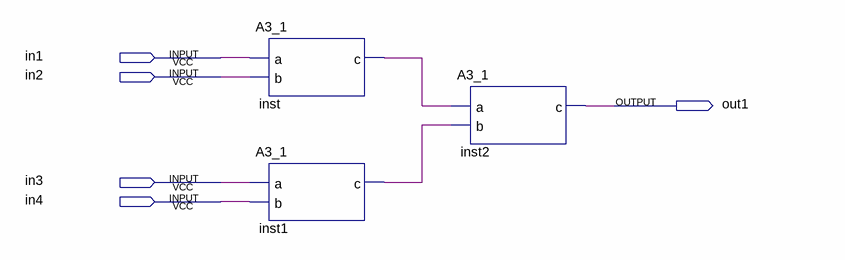
[diagram p0: schematic sheet]
// Quartus schematic A3_1_blocks.bdf as structural Verilog: 3 symbols, 5 pins
module A3_1_blocks (
  input  in1,
  input  in2,
  input  in3,
  input  in4,
  output out1
);

  wire inst1_c, inst_c;

  A3_1 inst (.a(in1), .b(in2), .c(inst_c));
  A3_1 inst1 (.a(in3), .b(in4), .c(inst1_c));
  A3_1 inst2 (.a(inst_c), .b(inst1_c), .c(out1));
endmodule
